# EAGLE schematic rat (EAGLE 8.5.1)
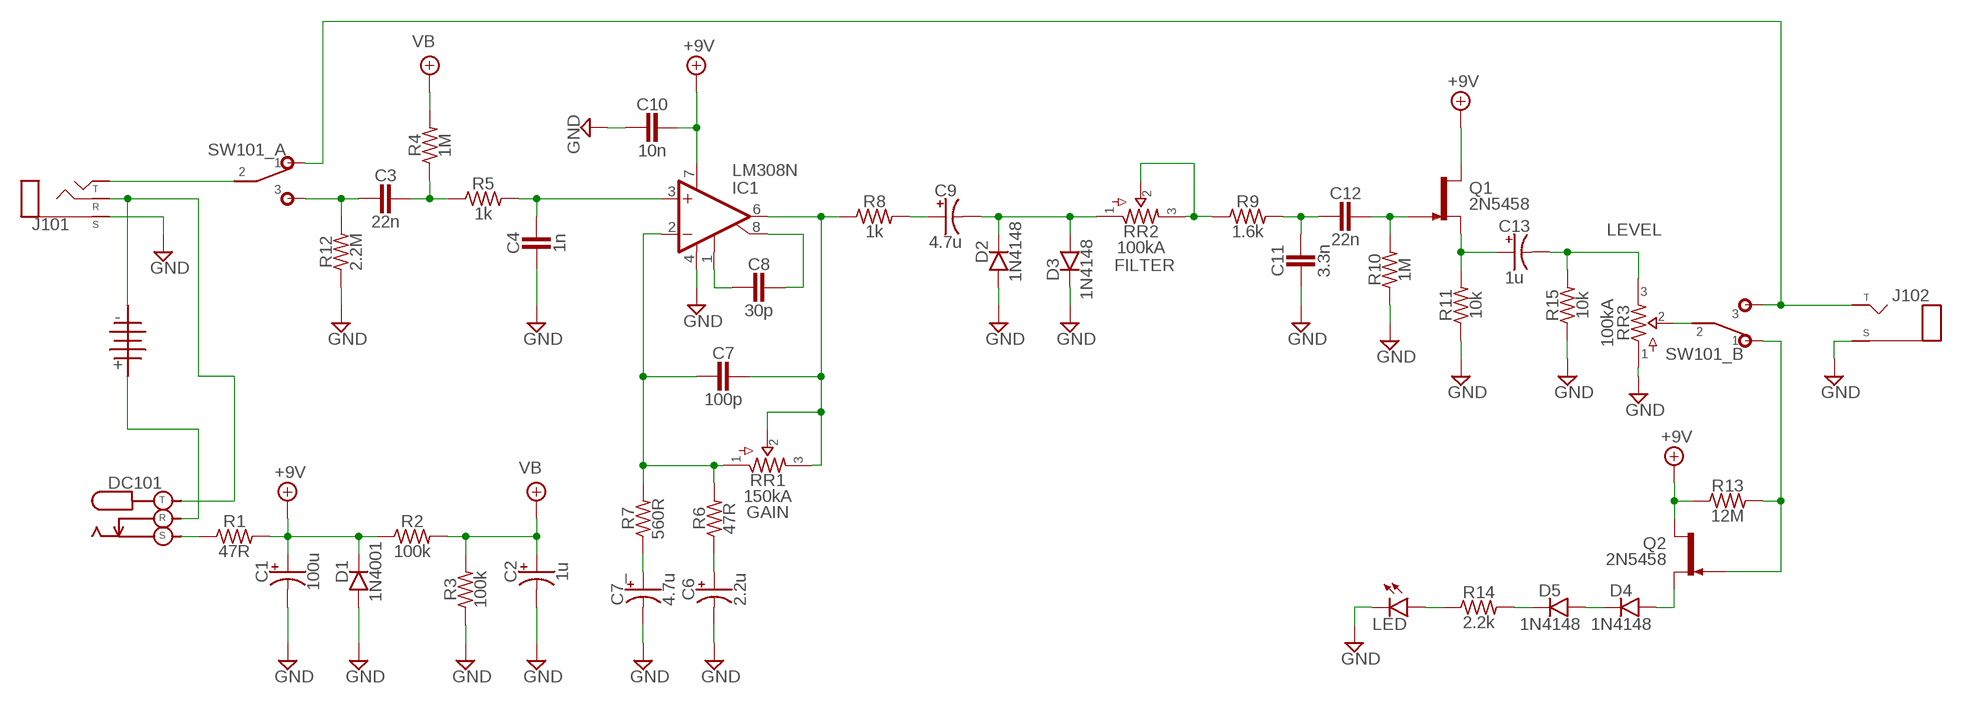
[diagram p0: schematic, sheet 1]

## Parts
1101  BATTERY  [TWO_PADS]
C1  100u  0400  [040_020]
C2  1u  0400  [040_020]
C3  22n  CER/FILMBOX.1  [BOX_SMALL]
C4  1n  CER/FILMBOX.1  [BOX_SMALL]
C6  2.2u  0500  [050_020]
C7  100p  CER/FILM2  [050X030_025_2]
C7_  4.7u  0500  [050_020]
C8  30p  CER/FILM2  [050X030_025_2]
C9  4.7u  0500  [050_020]
C10  10n  CER/FILM2  [050X030_025_2]
C11  3.3n  CER/FILMBOX.1  [BOX_SMALL]
C12  22n  CER/FILMBOX.1  [BOX_SMALL]
C13  1u  0500  [050_020]
D1  1N4001  DO35.2  [DO35-2]
D2  1N4148  DO35.2  [DO35-2]
D3  1N4148  DO35.2  [DO35-2]
D4  1N4148  DO35.2  [DO35-2]
D5  1N4148  DO35.2  [DO35-2]
DC101  DC_KOBICONN  [DC_KOBICONN]
IC1  LM308N  [DIL0]
J101  STEREO3PADS  [THREEPADS]
J102  MONO_JACK  [MONO_SW]
LED  LED  [3MM_D]
Q1  2N5458  2N5457  [TO92-]
Q2  2N5458  2N5457  [TO92-]
R1  47R  R_.3B  [R0207/3]
R2  100k  R_.3B  [R0207/3]
R3  100k  R_.3B  [R0207/3]
R4  1M  R_.3B  [R0207/3]
R5  1k  R_.3B  [R0207/3]
R6  47R  R_.3B  [R0207/3]
R7  560R  R_.3B  [R0207/3]
R8  1k  R_.3B  [R0207/3]
R9  1.6k  R_.3B  [R0207/3]
R10  1M  R_.3B  [R0207/3]
R11  10k  R_.3B  [R0207/3]
R12  2.2M  R_.3B  [R0207/3]
R13  12M  R_.3B  [R0207/3]
R14  2.2k  R_.3B  [R0207/3]
R15  10k  R_.3B  [R0207/3]
RR1  150kA  POTS16MM  [16MM]
RR2  100kA  POTS16MM  [16MM]
RR3  100kA  POTS16MM  [16MM]
SW101  DPDT  [DPDT]

## Nets
+9V: C1.+ C10.1 D1.C IC1.7(V+) Q1.3(D) Q2.3(D) R1.2 R2.1 R13.1
GND: C1.- C2.- C4.2 C6.- C7_.- C10.2 C11.2 D1.A D2.A D3.C IC1.4(V-) J101.SLEEVE(S) J102.S(SLEEVE) LED.P$1(C) R3.1 R10.1 R11.1 R12.1 R15.1 RR3.1
N$1: R9.1 RR2.2 RR2.3
N$2: C3.1 R4.1 R5.1
N$3: C4.1 IC1.3(+IN) R5.2
N$4: C9.+ R8.2
N$5: C6.+ R6.1
N$6: C8.2 IC1.1(CMP1)
N$7: C8.1 IC1.8(CMP2)
N$8: C7.1 IC1.6(OUT) R8.1 RR1.2 RR1.3
N$9: C7_.+ R7.1
N$11: C9.- D2.C D3.A RR2.1
N$12: J101.TIP(T) SW101.A2
N$13: C7.2 IC1.2(-IN) R6.2 R7.2 RR1.1
N$14: C3.2 R12.2 SW101.A3
N$15: C11.1 C12.2 R9.2
N$16: C12.1 Q1.1(G) R10.2
N$17: C13.+ Q1.2(S) R11.2
N$18: C13.- R15.2 RR3.3
N$19: RR3.2 SW101.B2
N$20: DC101.S R1.1
N$21: D5.C R14.2
N$22: Q2.1(G) R13.2 SW101.B1
N$23: D4.A Q2.2(S)
N$24: D4.C D5.A
N$25: LED.ANODE(A) R14.1
N$26: J102.T(TIP) SW101.A1 SW101.B3
N$27: 1101.T DC101.R
N$28: 1101.S DC101.T J101.RING(R)
VB: C2.+ R2.2 R3.2 R4.2

## Notes on the sheet
- LEVEL
- FILTER
- GAIN

## Library data of the parts
1101 = pedals-jacks:BATTERY
C1 C2 = pedals-capacitors-elec:040
C3 C4 C7 C8 C10-C12 = pedals-capacitors-film:CER/FILM: 47 - 120pF Xicon Ceramic Disc 2.5mm lead spacing
C6 C7_ C9 C13 = pedals-capacitors-elec:050
D1-D5 = pedals-diodes:DO35: DO-35 Package Diodes: 1N914
DC101 = pedals-jacks:DC_KOBICONN
IC1 = pedals-integrated circuits:LM308: OP AMP
J101 = pedals-jacks:STEREO
J102 = pedals-jacks:MONO: Mono 1/4" Phone Jack
LED = pedals-diodes:LED
Q1 Q2 = pedals-transistors:2N5457: N-CHANNEL JFET
R1-R15 = pedals-resistors:R_
RR1-RR3 = pedals-potentiometers:POTS
SW101 = pedals-switches:DPDT